# EasyEDA Pro project 穿越机H7飞控工程文件（241123）.epro, board H743FC4FPV_v0.5
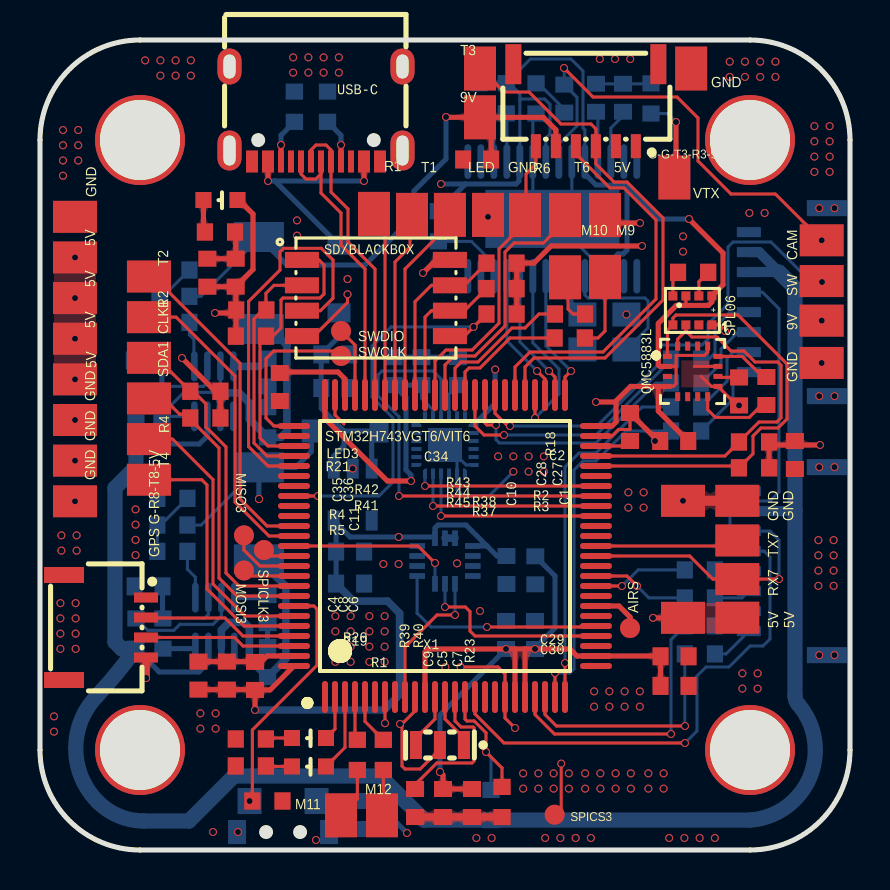
[diagram p26: board, top side]
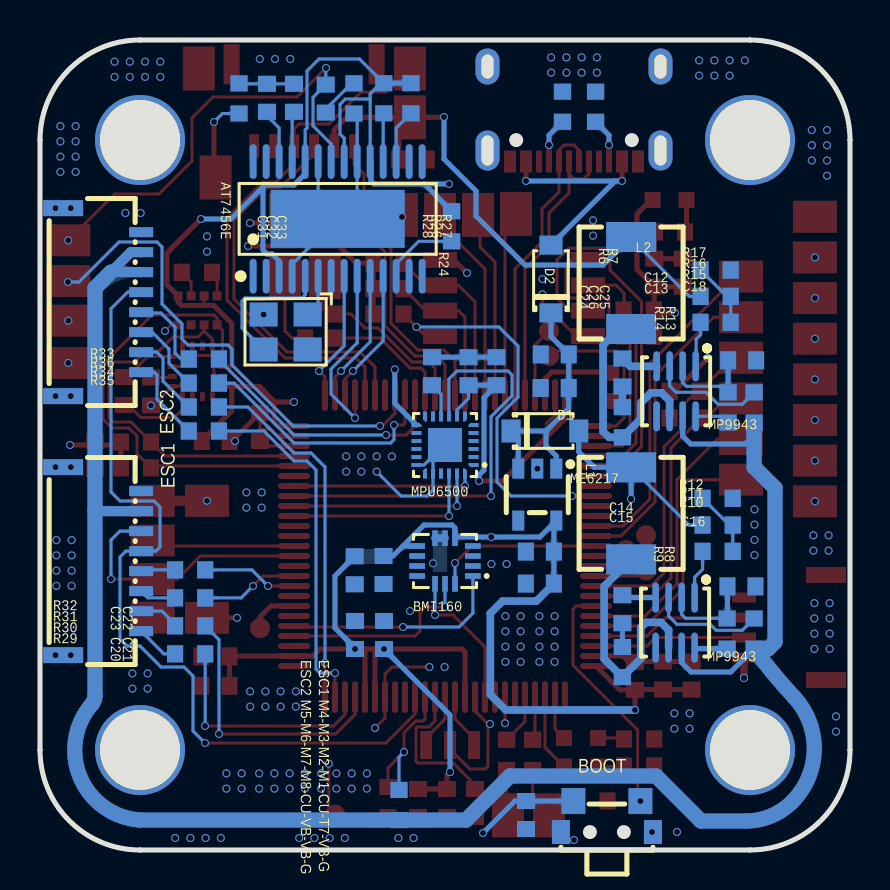
[diagram p27: board, bottom side, seen from below]

Outline 40.5 x 40.5 mm; copper layers: Top Layer, Inner1, Inner2, Bottom Layer. Coordinates in mm from the lower left corner of the outline.
Outline path: 0,35.5 0,5 arc(1.46,1.46) 5,0 35.5,0 arc(39.04,1.46) 40.5,5 40.5,35.5 arc(39.04,39.04) 35.5,40.5 5,40.5 arc(1.46,39.04) 0,35.5
Stack: Top Layer 0.035mm 外层铜厚1oz / Dielectric1 0.2104mm 7628 RC49% 8.6mil / Inner1 0.0152mm 内层铜厚 / Dielectric2 1.065mm 1.1mm H/HOZ 含铜 / Inner2 0.0152mm 内层铜厚 / Dielectric3 0.2104mm 7628 RC49% 8.6mil / Bottom Layer 0.035mm 外层铜厚1oz

## Design rules (mm)
template: 自定义配置
spacing copperThickness1oz (default): track to track 0.102, other pairs 0 to 0.3
spacing copperThickness2oz: track to track 0.203, other pairs 0.152 to 0.3
track width copperThickness1oz (default): min 0.127, default 0.254, max 2.54
track width copperThickness2oz: min 0.203, default 0.254, max 2.54
differential pair differentialPair (default): width min 0.127, default 0.254, max 2.54; gap min 0.152, default 0.152
via viaSize (default): diameter min 0.203, default 0.61, max 10; hole min 0.152, default 0.305, max 6.299

## Placement (name value [footprint] x y rotation side)
5V  -  [焊盘1.6*2.2mm]  29.05 32.85 180 top
5V#2  -  [焊盘1.6*2.2mm]  2.85 24.76 90 top
5V#3  -  [焊盘1.6*2.2mm]  35.97 10.81 90 top
5V#4  -  [焊盘1.6*2.2mm]  0.65 24.33 270 top
5V#5  -  [焊盘1.6*2.2mm]  2.85 26.8 90 top
5V#6  -  [焊盘1.6*2.2mm]  33.25 10.81 90 top
5V#7  -  [焊盘1.6*2.2mm]  0.65 30.43 270 top
9V  -  [焊盘1.6*2.2mm]  21.2 35.53 0 top
9V#2  -  [焊盘1.6*2.2mm]  37.99 27.27 270 top
27MHZ  27MHz  [OSC-SMD_4P-L3.2-W2.5-BL]  28.22 25.9 0 bottom
AIRS  -  [焊盘_圆——Debug]  29.5 11.1 0 top
AT7456E  AT7456E  [TSSOP-28_L9.7-W4.4-P0.65-LS6.4-BL-EP-2]  25.62 31.56 180 bottom
BMI160  BMI160  [LGA-14_L3.0-W2.5-P0.50-BL]  20.25 14.45 90 bottom
C1  100nF  [C0603]  37.75 19.75 270 top
C2  100nF  [C0603]  31.71 20.45 180 top
C3  100nF  [C0603]  16.2 1.75 270 bottom
C4  100nF  [C0603]  7.92 8.72 90 top
C5  100nF  [C0603]  20.15 2.35 270 top
C6  4.7uF  [C0603]  10.75 8.7 270 top
C7  100nF  [C0603]  21.6 2.35 270 top
C8  1uF  [C0603]  9.35 8.72 90 top
C9  100nF  [C0603]  18.75 2.35 270 top
C10  2.2uF  [C0603]  29.5 21.15 90 top
C11  2.2uF  [C0603]  11.99 23.15 270 top
C12  100nF  [C0603]  14.76 24.78 180 bottom
C13  22uF  [C0603]  14.76 23.1 180 bottom
C14  100nF  [C0603]  15.51 14.92 180 bottom
C15  22uF  [C0603]  15.51 13.32 180 bottom
C16  100nF  [C0603]  5.43 13.18 0 bottom
C17  100nF  [C0603]  11.38 12.04 270 bottom
C18  100nF  [C0603]  5.39 24.48 0 bottom
C19  100nF  [C0603]  11.38 23.88 270 bottom
C20  100nF  [C0603]  24.75 10.75 270 bottom
C21  100nF  [C0603]  23.3 10.75 270 bottom
C22  100nF  [C0603]  23.32 14 90 bottom
C23  100nF  [C0603]  24.76 13.98 90 bottom
C24  100nF  [C0603]  20.9 23.94 270 bottom
C25  100nF  [C0603]  17.68 23.94 270 bottom
C26  10nF  [C0603]  19.07 23.94 270 bottom
C27  220nF  [C0603]  36.32 22.95 270 top
C28  4.7uF  [C0603]  34.95 22.93 270 top
C29  100nF  [C0603]  31.73 9.68 180 top
C30  100nF  [C0603]  31.73 8.21 180 top
C31  22uF  [C0603]  29.15 37.61 90 bottom
C32  22uF  [C0603]  27.8 37.61 90 bottom
C33  100nF  [C0603]  26.21 37.57 90 bottom
C34  100nF  [C0603]  21.86 34.53 0 top
C35  10nF  [C0603]  9.78 28.87 90 top
C36  100nF  [C0603]  8.37 28.87 90 top
CAM  -  [焊盘1.6*2.2mm]  40.19 29.68 90 top
CLK1  -  [焊盘1.6*2.2mm]  6.55 23.81 90 top
D1  1N5819W  [SOD-123_L2.8-W1.8-LS3.7-RD]  15.26 20.95 180 bottom
D2  1N5819W  [SOD-123_L2.8-W1.8-LS3.7-RD]  14.95 28.55 90 bottom
ESC1 M4-M3-M2-M1-CU-T7-VB-G  HDGC1002WR-S-8P  [CONN-SMD_8P-P1.00_HDGC_HDGC1002WR-S-8P]  37.39 14.44 270 bottom
ESC2 M5-M6-M7-M8-CU-VB-VB-G  HDGC1002WR-S-8P  [conn-smd_8p-p1.00_hdgc_hdgc1002wr-s-8p]  37.39 27.39 270 bottom
G-G-T3-R3-9V-R6  HDGC1002WR-S-6P  [CONN-SMD_6P-P1.00_HDGC1002WR-S-6P]  27.29 37.24 180 top
GND  -  [焊盘1.6*2.2mm]  40.19 23.55 90 top
GND#2  -  [焊盘1.6*2.2mm]  31.76 37.97 0 top
GND#3  -  [焊盘1.6*2.2mm]  23.2 32.86 180 top
GND#4  -  [焊盘1.6*2.2mm]  2.85 18.67 90 top
GND#5  -  [焊盘1.6*2.2mm]  33.25 16.66 90 top
GND#6  -  [焊盘1.6*2.2mm]  0.65 22.3 270 top
GND#7  -  [焊盘1.6*2.2mm]  35.97 16.66 90 top
GND#8  -  [焊盘1.6*2.2mm]  2.85 16.64 90 top
GND#9  -  [焊盘1.6*2.2mm]  0.65 32.46 270 top
GPS G-R8-T8-5V  HDGC1002WR-S-4P  [CONN-SMD_4P-P1.00_HDGC_HDGC1002WR-S-4P]  3.25 11.12 270 top
L1  10uH  [IND-SMD_L5.5-W5.2]  10.94 16.83 90 bottom
L2  10uH  [IND-SMD_L5.5-W5.2]  10.94 28.35 90 bottom
LED  -  [焊盘1.6*2.2mm]  19.7 30.66 0 top
LED1  NCD0603R3  [LED0603-R-RD_RED]  13.45 5.6 0 top
LED2  NCD0603R3  [LED0603-R-RD_RED]  13.45 4.18 0 top
LED3  NCD0603R3  [LED0603-R-RD_RED]  9.02 32.5 0 top
M9  -  [焊盘1.6*2.2mm]  29.05 29.75 180 top
M10  -  [焊盘1.6*2.2mm]  27.05 29.74 180 top
M11  -  [焊盘1.6*2.2mm]  15.85 2.83 180 top
M12  -  [焊盘1.6*2.2mm]  17.9 2.83 180 top
ME6217  ME6217C33M5G  [SOT-23-5_L3.0-W1.7-P0.95-LS2.8-BR]  15.64 17.77 90 bottom
MP9943  -  [QFN-8_L3.0-W3.0-P0.65-BL]  8.74 11.37 0 bottom
MP9943#2  -  [QFN-8_L3.0-W3.0-P0.65-BL]  8.69 22.93 0 bottom
MPU6500  MPU6500  [QFN-24_L3.0-W3.0-P0.40-BL-EP]  20.25 20.25 90 bottom
NOREF  -  [Pad_e156]  5 35.5 0 top
NOREF#2  -  [Pad_e1514]  35.5 35.5 0 top
NOREF#3  -  [Pad_e158]  5 5 0 top
NOREF#4  -  [Pad_e157]  35.5 5 0 top
QMC5883L  QMC5883L  [LGA-16_L3.0-W3.0-P0.50-BL_SQ]  32.63 23.93 270 top
R1  10K  [R0603]  11.37 2.45 0 top
R1#2  -  [焊盘1.6*2.2mm]  17.5 32.91 180 top
R2  2.2K  [R0603]  35.7 20.4 180 top
R2#2  -  [焊盘1.6*2.2mm]  6.55 25.84 90 top
R3  2.2K  [R0603]  35.7 19.11 180 top
R4  2.2K  [R0603]  8.27 22.94 0 top
R4#2  -  [焊盘1.6*2.2mm]  4.35 21.35 270 top
R5  2.2K  [R0603]  8.27 21.6 0 top
R6  5.1kΩ  [焊盘1.6*2.2mm]  23.45 30.65 0 top
R6#2  -  [R0603]  14.38 37.16 270 bottom
R7  5.1kΩ  [R0603]  12.72 37.16 270 bottom
R8  10K  [R0603]  4.79 10.82 90 bottom
R9  100K  [R0603]  6.14 10.82 270 bottom
R10  51K  [R0603]  6.62 14.93 180 bottom
R11  41.2K  [R0603]  6.62 16.25 0 bottom
R12  7.68K  [R0603]  6.62 17.58 0 bottom
R13  10K  [R0603]  4.79 22.13 90 bottom
R14  100K  [R0603]  6.09 22.13 270 bottom
R15  51K  [R0603]  6.72 26.38 180 bottom
R16  41.2K  [R0603]  6.72 27.68 0 bottom
R17  4.02K  [R0603]  6.72 29 0 bottom
R18  100K  [R0603]  32.66 28.88 180 top
R19  470R  [R0603]  10.54 5.55 180 top
R20  470R  [R0603]  10.54 4.2 180 top
R21  470R  [R0603]  9 30.9 0 top
R22  10K  [R0603]  22.55 2.25 270 bottom
R23  1K  [R0603]  23.1 2.4 90 top
R24  1K  [R0603]  19.92 31.19 90 bottom
R25  75R  [R0603]  30.55 37.58 270 bottom
R26  10K  [R0603]  23.31 37.59 90 bottom
R27  10K  [R0603]  21.95 37.59 90 bottom
R28  75R  [R0603]  24.8 37.58 90 bottom
R29  120R  [R0603]  32.99 9.81 180 bottom
R30  120R  [R0603]  32.99 11.21 180 bottom
R31  120R  [R0603]  32.99 12.61 180 bottom
R32  120R  [R0603]  32.99 14.01 180 bottom
R33  120R  [R0603]  32.31 24.55 180 bottom
R34  120R  [R0603]  32.31 22.15 180 bottom
R35  120R  [R0603]  32.31 20.95 180 bottom
R36  120R  [R0603]  32.31 23.34 180 bottom
R37  120R  [R0603]  26.49 25.6 180 top
R38  120R  [R0603]  26.5 26.8 180 top
R39  120R  [R0603]  15.87 4.75 90 top
R40  120R  [R0603]  17.17 4.75 90 top
R41  10K  [R0603]  10.55 25.69 180 top
R42  10K  [R0603]  10.56 27 180 top
R43  10K  [R0603]  23.08 29.34 180 top
R44  10K  [R0603]  23.08 28.07 180 top
R45  10K  [R0603]  23.08 26.8 180 top
R46  20R  [R0603]  11.38 9.4 90 bottom
R47  20R  [R0603]  11.38 21.39 90 bottom
RX7  -  [焊盘1.6*2.2mm]  35.97 12.75 90 top
SD/BLACKBOX  CSNP1GCR01-BOW  [LGA-8_L6.0-W8.0-P1.27-TL]  16.8 27.6 0 top
SDA1  -  [焊盘1.6*2.2mm]  6.55 21.78 90 top
SPICS3  -  [焊盘_圆——Debug]  25.73 1.76 0 top
SPL06  SPL06-001  [SENSOR-SMD_SPL06-001]  32.62 26.98 0 top
STM32H743VGT6/VIT6  STM32H743VGT6  [LQFP-100_L14.0-W14.0-P0.50-LS16.0-BL]  20.25 15.2 0 top
SW  -  [焊盘1.6*2.2mm]  40.19 27.65 90 top
SW1  TS24CA  [SW-SMD_TS24CA]  12.15 1.67 0 bottom
SWCLK  -  [焊盘_圆——Debug]  15.05 24.7 0 top
SWDIO  -  [焊盘_圆——Debug]  15.05 25.95 0 top
T1  -  [焊盘1.6*2.2mm]  19.4 32.86 180 top
T2  -  [焊盘1.6*2.2mm]  6.55 27.87 90 top
T3  -  [焊盘1.6*2.2mm]  21.2 37.97 0 top
T4  -  [焊盘1.6*2.2mm]  4.35 19.31 270 top
T6  -  [焊盘1.6*2.2mm]  25.45 30.65 0 top
TX7  -  [焊盘1.6*2.2mm]  35.97 14.68 90 top
U16  -  [焊盘_圆——Debug]  10.2 13.98 0 top
U17  -  [焊盘_圆——Debug]  10.2 15.74 0 top
U18  -  [焊盘_圆——Debug]  11.2 15 0 top
USB-C  TYPE-C 16PIN 2MD(073)  [USB-C-SMD_TYPE-C-6PIN-2MD-073]  13.8 36.8 180 top
VTX  -  [焊盘1.6*2.2mm]  30.92 32.53 0 top
X1  8M  [OSC-SMD_3P-L3.2-W1.3-P1.20-L]  20 5.25 180 top

## Footprints (pads in the part's own frame, mm; a bottom-side part is the same pattern mirrored in y, then rotated)
C0603
  rect 0.8x0.9 smd: 1(-0.7,0) 2(0.7,0)
CONN-SMD_4P-P1.00_HDGC_HDGC1002WR-S-4P
  rect 0.5x1.2 smd: 1(-1.5,2.05) 2(-0.5,2.05) 3(0.5,2.05) 4(1.5,2.05)
  rect 0.8x2 smd: 5(2.625,-2.05) 6(-2.625,-2.05)
CONN-SMD_6P-P1.00_HDGC1002WR-S-6P
  rect 0.5x1.2 smd: 1(-2.5,2.05) 2(-1.5,2.05) 3(-0.5,2.05) 4(0.5,2.05) 5(1.5,2.05) 6(2.5,2.05)
  rect 0.8x2 smd: 7(3.625,-2.05) 8(-3.625,-2.05)
conn-smd_8p-p1.00_hdgc_hdgc1002wr-s-8p
  rect 0.5x1.2 smd: 1(-3.5,1.95) 2(-2.5,1.95) 3(-1.5,1.95) 4(-0.5,1.95) 5(0.5,1.95) 6(1.5,1.95) 7(2.5,1.95) 8(3.5,1.95)
  rect 0.8x2 smd: 9(4.7,-1.95) 10(-4.7,-1.95)
CONN-SMD_8P-P1.00_HDGC_HDGC1002WR-S-8P
  rect 0.5x1.2 smd: 1(-3.5,1.95) 2(-2.5,1.95) 3(-1.5,1.95) 4(-0.5,1.95) 5(0.5,1.95) 6(1.5,1.95) 7(2.5,1.95) 8(3.5,1.95)
  rect 0.8x2 smd: 9(4.7,-1.95) 10(-4.7,-1.95)
IND-SMD_L5.5-W5.2
  rect 1.5x2.5 smd: 1(-2.3,0) 2(2.3,0)
LED0603-R-RD_RED
  rect 0.8x0.8 smd: 1(0.851,0) 2(-0.851,0)
LGA-8_L6.0-W8.0-P1.27-TL
  rect 1.7x0.8 smd: 1(-3.7,1.905) 2(-3.7,0.635) 3(-3.7,-0.635) 4(-3.7,-1.905) 5(3.7,-1.905) 6(3.7,-0.635) 7(3.7,0.635) 8(3.7,1.905)
LGA-14_L3.0-W2.5-P0.50-BL
  rect 0.28x0.785 smd: 1(-0.75,-1.393) 2(-0.25,-1.393) 3(0.25,-1.393) 4(0.75,-1.393) 8(0.75,1.393) 9(0.25,1.393) 10(-0.25,1.393) 11(-0.75,1.393)
  rect 0.785x0.28 smd: 5(1.143,-0.5) 6(1.143,0) 7(1.143,0.5) 12(-1.143,0.5) 13(-1.143,0) 14(-1.143,-0.5)
LGA-16_L3.0-W3.0-P0.50-BL_SQ
  rect 0.25x0.45 smd: 1(-0.75,-1.263) 2(-0.25,-1.263) 3(0.25,-1.263) 4(0.75,-1.263) 9(0.75,1.263) 10(0.25,1.263) 11(-0.25,1.263) 12(-0.75,1.263)
  rect 0.45x0.25 smd: 5(1.263,-0.75) 6(1.263,-0.25) 7(1.263,0.25) 8(1.263,0.75) 13(-1.263,0.75) 14(-1.263,0.25) 15(-1.263,-0.25) 16(-1.263,-0.75)
LQFP-100_L14.0-W14.0-P0.50-LS16.0-BL
  oval 0.3x1.6 smd: 1(-6,-7.55) 2(-5.5,-7.55) 3(-5,-7.55) 4(-4.5,-7.55) 5(-4,-7.55) 6(-3.5,-7.55) 7(-3,-7.55) 8(-2.5,-7.55) 9(-2,-7.55) 10(-1.5,-7.55) 11(-1,-7.55) 12(-0.5,-7.55) 13(0,-7.55) 14(0.5,-7.55) 15(1,-7.55) 16(1.5,-7.55) 17(2,-7.55) 18(2.5,-7.55) 19(3,-7.55) 20(3.5,-7.55) 21(4,-7.55) 22(4.5,-7.55) 23(5,-7.55) 24(5.5,-7.55) 25(6,-7.55) 51(6,7.55) 52(5.5,7.55) 53(5,7.55) 54(4.5,7.55) 55(4,7.55) 56(3.5,7.55) 57(3,7.55) 58(2.5,7.55) 59(2,7.55) 60(1.5,7.55) 61(1,7.55) 62(0.5,7.55) 63(0,7.55) 64(-0.5,7.55) 65(-1,7.55) 66(-1.5,7.55) 67(-2,7.55) 68(-2.5,7.55) 69(-3,7.55) 70(-3.5,7.55) 71(-4,7.55) 72(-4.5,7.55) 73(-5,7.55) 74(-5.5,7.55) 75(-6,7.55)
  oval 1.6x0.3 smd: 26(7.55,-6) 27(7.55,-5.5) 28(7.55,-5) 29(7.55,-4.5) 30(7.55,-4) 31(7.55,-3.5) 32(7.55,-3) 33(7.55,-2.5) 34(7.55,-2) 35(7.55,-1.5) 36(7.55,-1) 37(7.55,-0.5) 38(7.55,0) 39(7.55,0.5) 40(7.55,1) 41(7.55,1.5) 42(7.55,2) 43(7.55,2.5) 44(7.55,3) 45(7.55,3.5) 46(7.55,4) 47(7.55,4.5) 48(7.55,5) 49(7.55,5.5) 50(7.55,6) 76(-7.55,6) 77(-7.55,5.5) 78(-7.55,5) 79(-7.55,4.5) 80(-7.55,4) 81(-7.55,3.5) 82(-7.55,3) 83(-7.55,2.5) 84(-7.55,2) 85(-7.55,1.5) 86(-7.55,1) 87(-7.55,0.5) 88(-7.55,0) 89(-7.55,-0.5) 90(-7.55,-1) 91(-7.55,-1.5) 92(-7.55,-2) 93(-7.55,-2.5) 94(-7.55,-3) 95(-7.55,-3.5) 96(-7.55,-4) 97(-7.55,-4.5) 98(-7.55,-5) 99(-7.55,-5.5) 100(-7.55,-6)
OSC-SMD_3P-L3.2-W1.3-P1.20-L
  rect 0.6x1.4 smd: 1(-1.199,0) 2(0,0) 3(1.199,0)
OSC-SMD_4P-L3.2-W2.5-BL
  rect 1.4x1.2 smd: 1(-1.1,-0.875) 2(1.1,-0.875) 3(1.1,0.875) 4(-1.1,0.875)
Pad_e156
  round 4.5 hole 4: 101(0,0)
Pad_e157
  round 4.5 hole 4: 101(0,0)
Pad_e158
  round 4.5 hole 4: 101(0,0)
Pad_e1514
  round 4.5 hole 4: 101(0,0)
QFN-8_L3.0-W3.0-P0.65-BL
  oval 0.33x1.5 smd: 1(-0.975,-1.25) 2(-0.325,-1.25) 3(0.325,-1.25) 4(0.975,-1.25) 5(0.975,1.25) 6(0.325,1.25) 7(-0.325,1.25) 8(-0.975,1.25)
QFN-24_L3.0-W3.0-P0.40-BL-EP
  custom 0.2x0.506 smd: 1(-1,-1.427) 6(1,-1.427) 13(1,1.427) 18(-1,1.427)
  rect 0.2x0.505 smd: 2(-0.6,-1.427) 3(-0.2,-1.427) 4(0.2,-1.427) 5(0.6,-1.427) 14(0.6,1.427) 15(0.2,1.427) 16(-0.2,1.427) 17(-0.6,1.427)
  custom 0.506x0.2 smd: 7(1.427,-1) 12(1.427,1) 19(-1.427,1) 24(-1.427,-1)
  rect 0.505x0.2 smd: 8(1.427,-0.6) 9(1.427,-0.2) 10(1.427,0.2) 11(1.427,0.6) 20(-1.427,0.6) 21(-1.427,0.2) 22(-1.427,-0.2) 23(-1.427,-0.6)
  rect 1.7x1.7 smd: 25(0,0)
R0603
  rect 0.806x0.864 smd: 1(-0.753,0) 2(0.753,0)
SENSOR-SMD_SPL06-001
  rect 0.45x0.45 smd: 1(0.975,-0.725) 2(0.325,-0.725) 3(-0.325,-0.725) 4(-0.975,-0.725) 5(-0.975,0.725) 6(-0.325,0.725) 7(0.325,0.725) 8(0.975,0.725)
SOD-123_L2.8-W1.8-LS3.7-RD
  rect 0.95x1.15 smd: 1(-1.692,0) 2(1.692,0)
SOT-23-5_L3.0-W1.7-P0.95-LS2.8-BR
  rect 1x0.6 smd: 1(1.3,-0.95) 2(1.3,0) 3(1.3,0.95) 4(-1.3,0.95) 5(-1.3,-0.95)
SW-SMD_TS24CA
  rect 0.9x1.2 smd: 1(-2.3,0.775) 2(2.3,0.775)
  rect 1.2x1.3 smd: 3(-1.675,-0.775) 4(1.675,-0.775)
TSSOP-28_L9.7-W4.4-P0.65-LS6.4-BL-EP-2
  oval 0.343x1.732 smd: 1(-4.225,-2.866) 2(-3.575,-2.866) 3(-2.925,-2.866) 4(-2.275,-2.866) 5(-1.625,-2.866) 6(-0.975,-2.866) 7(-0.325,-2.866) 8(0.325,-2.866) 9(0.975,-2.866) 10(1.625,-2.866) 11(2.275,-2.866) 12(2.925,-2.866) 13(3.575,-2.866) 14(4.225,-2.866) 15(4.225,2.866) 16(3.575,2.866) 17(2.925,2.866) 18(2.275,2.866) 19(1.625,2.866) 20(0.975,2.866) 21(0.325,2.866) 22(-0.325,2.866) 23(-0.975,2.866) 24(-1.625,2.866) 25(-2.275,2.866) 26(-2.925,2.866) 27(-3.575,2.866) 28(-4.225,2.866)
  rect 6.7x2.9 smd: 29(0,0)
USB-C-SMD_TYPE-C-6PIN-2MD-073
  rect 0.6x1.1 smd: 1(-3.2,2.375) 2(-2.4,2.375) 11(2.4,2.375) 12(3.2,2.375)
  rect 0.3x1.1 smd: 3(-1.75,2.375) 4(-1.25,2.375) 5(-0.75,2.375) 6(-0.25,2.375) 7(0.25,2.375) 8(0.75,2.375) 9(1.25,2.375) 10(1.75,2.375)
  oval 1.2x2 hole 0.6x1.5: 13(-4.325,1.825) 14(4.325,1.825)
  oval 1.2x1.8 hole 0.6x1.2: 13(-4.325,-2.375) 14(4.325,-2.375)
焊盘1.6*2.2mm
  rect 1.6x2.2 smd: 1(0.8,1.1)
焊盘_圆——Debug
  round 1 smd: 1(0,0)

## Nets
4V5: C12.2 C13.2 D1.1 D2.1 ME6217.1 ME6217.3
5V_BEC: 5V.1 5V#2.1 5V#3.1 5V#4.1 5V#5.1 5V#6.1 5V#7.1 D1.2 GPS G-R8-T8-5V.4 L1.2 R11.2
5V_USB: D2.2 USB-C.2 USB-C.11
9V_BEC: 9V.1 9V#2.1 C34.2 G-G-T3-R3-9V-R6.5 L2.2 R16.2
GND: 27MHZ.2 27MHZ.4 AT7456E.4 AT7456E.20 AT7456E.23 AT7456E.29 BMI160.6 BMI160.7 C1.2 C2.2 C3.2 C4.2 C5.2 C6.1 C7.2 C8.2 C9.2 C10.2 C11.2 C12.1 C13.1 C14.1 C15.1 C16.1 C18.1 C20.1 C21.1 C22.1 C23.1 C24.1 C25.1 C26.1 C28.2 C29.1 C30.1 C34.1 C35.2 C36.2 ESC1 M4-M3-M2-M1-CU-T7-VB-G.1 ESC1 M4-M3-M2-M1-CU-T7-VB-G.9 ESC1 M4-M3-M2-M1-CU-T7-VB-G.10 ESC2 M5-M6-M7-M8-CU-VB-VB-G.1 ESC2 M5-M6-M7-M8-CU-VB-VB-G.9 ESC2 M5-M6-M7-M8-CU-VB-VB-G.10 G-G-T3-R3-9V-R6.1 G-G-T3-R3-9V-R6.2 G-G-T3-R3-9V-R6.7 G-G-T3-R3-9V-R6.8 GND.1 GND#2.1 GND#3.1 GND#4.1 GND#5.1 GND#6.1 GND#7.1 GND#8.1 GND#9.1 GPS G-R8-T8-5V.1 GPS G-R8-T8-5V.5 GPS G-R8-T8-5V.6 ME6217.2 MP9943.5 MP9943#2.5 MPU6500.18 MPU6500.20 MPU6500.25 NOREF.101 NOREF#2.101 NOREF#3.101 NOREF#4.101 QMC5883L.9 QMC5883L.11 R1.2 R6#2.1 R7.1 R12.1 R17.1 R18.1 R19.2 R20.2 R21.2 R23.1 R28.1 SD/BLACKBOX.4 SPL06.1 SPL06.7 STM32H743VGT6/VIT6.10 STM32H743VGT6/VIT6.19 STM32H743VGT6/VIT6.26 STM32H743VGT6/VIT6.49 STM32H743VGT6/VIT6.74 STM32H743VGT6/VIT6.99 SW1.1 SW1.2 USB-C.1 USB-C.12 USB-C.13 USB-C.14 X1.2
VBAT: ESC1 M4-M3-M2-M1-CU-T7-VB-G.2 ESC2 M5-M6-M7-M8-CU-VB-VB-G.2 ESC2 M5-M6-M7-M8-CU-VB-VB-G.3 MP9943.7 MP9943#2.7 R8.1 R13.1 R22.2
VDD_MCU: AT7456E.3 AT7456E.19 AT7456E.21 AT7456E.24 BMI160.5 BMI160.8 C1.1 C2.1 C3.1 C4.1 C5.1 C6.2 C7.1 C8.1 C14.2 C15.2 C20.2 C21.2 C22.2 C23.2 C25.2 C26.2 C29.2 C30.2 C35.1 C36.1 LED3.1 ME6217.5 MPU6500.8 MPU6500.13 QMC5883L.2 QMC5883L.4 QMC5883L.13 R2.1 R3.1 R4.2 R5.2 R24.2 R26.2 R27.2 R41.2 R42.2 R43.1 R44.1 R45.1 SD/BLACKBOX.8 SPL06.6 SPL06.8 STM32H743VGT6/VIT6.11 STM32H743VGT6/VIT6.20 STM32H743VGT6/VIT6.21 STM32H743VGT6/VIT6.27 STM32H743VGT6/VIT6.50 STM32H743VGT6/VIT6.75 STM32H743VGT6/VIT6.100 SW1.4
AIRS: AIRS.1 STM32H743VGT6/VIT6.32
BEEPER: STM32H743VGT6/VIT6.77
BOOT0: R1.1 STM32H743VGT6/VIT6.94 SW1.3
CAN_RX: STM32H743VGT6/VIT6.82
CAN_TX: STM32H743VGT6/VIT6.81
EXTI_CS1: STM32H743VGT6/VIT6.85
EXTI_CS2: STM32H743VGT6/VIT6.1
FB_5V: MP9943.1 R10.1
FB_9V: MP9943#2.1 R15.1
I2C1_CLK: CLK1.1 R4.1 STM32H743VGT6/VIT6.92
I2C1_SDA: R5.1 SDA1.1 STM32H743VGT6/VIT6.93
I2C2_SCL: QMC5883L.1 R3.2 SPL06.4 STM32H743VGT6/VIT6.46
I2C2_SDA: QMC5883L.16 R2.2 SPL06.3 STM32H743VGT6/VIT6.47
LC_5V: L1.1 MP9943.6 R46.1
LC_9V: L2.1 MP9943#2.6 R47.1
LED_0: LED1.1 STM32H743VGT6/VIT6.2
LED_1: LED2.1 STM32H743VGT6/VIT6.3
NRST: C9.1 STM32H743VGT6/VIT6.14
OTG_FS_DM: STM32H743VGT6/VIT6.70 USB-C.5 USB-C.7
OTG_FS_DP: STM32H743VGT6/VIT6.71 USB-C.6 USB-C.8
PWM_1: R32.2 STM32H743VGT6/VIT6.34
PWM_2: R31.2 STM32H743VGT6/VIT6.35
PWM_3: R30.2 STM32H743VGT6/VIT6.22
PWM_4: R29.2 STM32H743VGT6/VIT6.23
PWM_5: R35.2 STM32H743VGT6/VIT6.24
PWM_6: R34.2 STM32H743VGT6/VIT6.25
PWM_7: R36.2 STM32H743VGT6/VIT6.59
PWM_8: R33.2 STM32H743VGT6/VIT6.60
PWM_9: R37.2 STM32H743VGT6/VIT6.61
PWM_10: R38.2 STM32H743VGT6/VIT6.62
PWM_11: R39.2 STM32H743VGT6/VIT6.4
PWM_12: R40.2 STM32H743VGT6/VIT6.5
PWM_SW_2812: LED.1 STM32H743VGT6/VIT6.67
RSSI: STM32H743VGT6/VIT6.33
SDIO_CLK: SD/BLACKBOX.3 STM32H743VGT6/VIT6.80
SDIO_CMD: R45.2 SD/BLACKBOX.5 STM32H743VGT6/VIT6.83
SDIO_D0: R44.2 SD/BLACKBOX.6 STM32H743VGT6/VIT6.65
SDIO_D1: R43.2 SD/BLACKBOX.7 STM32H743VGT6/VIT6.66
SDIO_D2: R41.1 SD/BLACKBOX.1 STM32H743VGT6/VIT6.78
SDIO_D3: R42.1 SD/BLACKBOX.2 STM32H743VGT6/VIT6.79
SENS_CUR: ESC1 M4-M3-M2-M1-CU-T7-VB-G.4 ESC2 M5-M6-M7-M8-CU-VB-VB-G.4 STM32H743VGT6/VIT6.16
SENS_VOL: R22.1 R23.2 STM32H743VGT6/VIT6.15
SPI1_IMU1_CS: BMI160.12 STM32H743VGT6/VIT6.9
SPI1_MISO: BMI160.1 STM32H743VGT6/VIT6.30
SPI1_MOSI: BMI160.14 STM32H743VGT6/VIT6.88
SPI1_SCLK: BMI160.13 STM32H743VGT6/VIT6.29
SPI2_MISO: AT7456E.11 STM32H743VGT6/VIT6.53
SPI2_MOSI: AT7456E.9 STM32H743VGT6/VIT6.54
SPI2_OSD_CS: AT7456E.8 STM32H743VGT6/VIT6.51
SPI2_SCLK: AT7456E.10 STM32H743VGT6/VIT6.52
SPI3_IMU3_CS: SPICS3.1 STM32H743VGT6/VIT6.7
SPI3_MISO: STM32H743VGT6/VIT6.90 U17.1
SPI3_MOSI: STM32H743VGT6/VIT6.91 U16.1
SPI3_SCLK: STM32H743VGT6/VIT6.89 U18.1
SPI4_IMU2_CS: MPU6500.22 STM32H743VGT6/VIT6.41
SPI4_MISO: MPU6500.9 STM32H743VGT6/VIT6.43
SPI4_MOSI: MPU6500.24 STM32H743VGT6/VIT6.44
SPI4_SCLK: MPU6500.23 STM32H743VGT6/VIT6.42
SW_CAMERA: STM32H743VGT6/VIT6.58 SW.1
SW_POWER: STM32H743VGT6/VIT6.57
SWD_SWCLK: STM32H743VGT6/VIT6.76 SWCLK.1
SWD_SWDIO: STM32H743VGT6/VIT6.72 SWDIO.1
UART1_RX: R1#2.1 STM32H743VGT6/VIT6.69
UART1_TX: STM32H743VGT6/VIT6.68 T1.1
UART2_RX: R2#2.1 STM32H743VGT6/VIT6.87
UART2_TX: STM32H743VGT6/VIT6.86 T2.1
UART3_RX: G-G-T3-R3-9V-R6.4 STM32H743VGT6/VIT6.56
UART3_TX: G-G-T3-R3-9V-R6.3 STM32H743VGT6/VIT6.55 T3.1
UART4_RX: R4#2.1 STM32H743VGT6/VIT6.95
UART4_TX: STM32H743VGT6/VIT6.96 T4.1
UART6_RX: G-G-T3-R3-9V-R6.6 R6.1 STM32H743VGT6/VIT6.64
UART6_TX: STM32H743VGT6/VIT6.63 T6.1
UART7_CTS: STM32H743VGT6/VIT6.40
UART7_RTS: STM32H743VGT6/VIT6.39
UART7_RX: ESC1 M4-M3-M2-M1-CU-T7-VB-G.3 RX7.1 STM32H743VGT6/VIT6.37
UART7_TX: STM32H743VGT6/VIT6.38 TX7.1
UART8_RX: GPS G-R8-T8-5V.2 STM32H743VGT6/VIT6.97
UART8_TX: GPS G-R8-T8-5V.3 STM32H743VGT6/VIT6.98
VCAP1: C10.1 STM32H743VGT6/VIT6.48
VCAP2: C11.1 STM32H743VGT6/VIT6.73
VIDIN: AT7456E.22 C33.2 CAM.1
VTX: R25.2 VTX.1
$1N2867: STM32H743VGT6/VIT6.12 X1.3
$1N2871: STM32H743VGT6/VIT6.13 X1.1
$1N3300: R7.2 USB-C.10
$1N3472: R6#2.2 USB-C.4
$1N5215: MP9943.3 R8.2
$1N5401: C17.1 MP9943.4
$1N5477: C16.2 MP9943.2 R9.1
$1N5478: MP9943.8 R9.2
$1N5616: R10.2 R11.1 R12.2
$1N5946: MP9943#2.3 R13.2
$1N5955: C19.1 MP9943#2.4
$1N5966: C18.2 MP9943#2.2 R14.1
$1N5971: MP9943#2.8 R14.2
$1N5978: R15.2 R16.1 R17.2
$1N6188: R18.2 SPL06.5
$1N7216: C24.2 MPU6500.10
$1N7601: C27.2 QMC5883L.8
$1N7606: C27.1 QMC5883L.12
$1N7687: C28.1 QMC5883L.10
$1N8096: LED1.2 R19.1
$1N8099: LED2.2 R20.1
$1N8102: LED3.2 R21.1
$1N8750: 27MHZ.3 AT7456E.5
$1N8757: 27MHZ.1 AT7456E.6
$1N8872: AT7456E.12 R24.1
$1N10347: AT7456E.26 C31.1
$1N10350: AT7456E.25 C32.1
$1N10453: C31.2 C32.2 R25.1
$1N10536: AT7456E.18 R26.1
$1N10539: AT7456E.17 R27.1
$1N10759: C33.1 R28.2
$1N44323: C17.2 R46.2
$1N44357: C19.2 R47.2
$2N2764: ESC1 M4-M3-M2-M1-CU-T7-VB-G.8 R29.1
$2N2888: ESC1 M4-M3-M2-M1-CU-T7-VB-G.7 R30.1
$2N2891: ESC1 M4-M3-M2-M1-CU-T7-VB-G.6 R31.1
$2N2894: ESC1 M4-M3-M2-M1-CU-T7-VB-G.5 R32.1
$2N3208: M9.1 R37.1
$2N3210: M10.1 R38.1
$2N3307: M11.1 R39.1
$2N3309: M12.1 R40.1
$2N5119: ESC2 M5-M6-M7-M8-CU-VB-VB-G.5 R33.1
$2N5121: ESC2 M5-M6-M7-M8-CU-VB-VB-G.7 R34.1
$2N5123: ESC2 M5-M6-M7-M8-CU-VB-VB-G.8 R35.1
$2N5125: ESC2 M5-M6-M7-M8-CU-VB-VB-G.6 R36.1

Pads without a net: AT7456E 1 2 7 13 14 15 16 27 28; BMI160 2 3 4 9 10 11; ME6217 4; MPU6500 1 2 3 4 5 6 7 11 12 14 15 16 17 19 21; QMC5883L 3 5 6 7 14 15; SPL06 2; STM32H743VGT6/VIT6 6 8 17 18 28 31 36 45 84; USB-C 3 9

## Via types
v1: diameter 0.4, hole 0.3, Top Layer to Bottom Layer, 244 vias

## Routing (per net, layer and track width the routed paths; a pad name or vN(x,y) marks a point on that pad's centre or on a via; arc(x,y) is an arc through that point)
4V5: length 12.6
  Bottom Layer w0.254: ME6217.3 16.59,20.59 D1.1 15.2,20.95 ; 15.2,20.95 14.06,22.09 C13.2 C12.2 14.95,25.67 D2.1 ; 15.2,20.95 15.2,20.21 14.69,19.7 ME6217.1
5V_BEC: length 105.1
  Top Layer w0.254: v1(30,31.35) 28.55,31.35 28.25,31.65 ; 5V#6.1 v1(30.65,11.61)
  Top Layer w0.381: v1(5.3,8.6) 5.3,9.63
  Inner2 w0.381: v1(5.3,8.6) 9.75,8.6 10.95,9.8 v1(10.95,17.55)
  Inner2 w0.508: v1(1.75,29.63) v1(1.75,27.6) v1(1.75,25.56) v1(1.75,23.53)
  Inner2 w0.762: v1(1.75,23.53) 1.77,23.55 4.95,23.55 ; 4.95,23.55 4.95,29.9 7.75,32.7 18.15,32.7 20.65,35.2 28.45,35.2 30,33.65 v1(30,31.35) ; 4.95,23.55 v1(10.95,17.55) 15.4,13.1 23.7,13.1 25.19,11.61 v1(30.65,11.61)
  Bottom Layer w0.152: L1.2 8.06,16.25 R11.2
  Bottom Layer w0.254: D1.2 13.56,19.91 12.78,19.13 L1.2 10.94,17.56
5V_USB: length 11.3
  Top Layer w0.254: USB-C.11 v1(11.4,33.45) ; USB-C.2 v1(16.2,33.45)
  Bottom Layer w0.254: 11.74,33.45 D2.2 ; 11.74,33.45 v1(16.2,33.45) ; 11.74,33.45 v1(11.4,33.45)
9V_BEC: length 51.6
  Top Layer w0.254: C34.2 22.56,36.08 9V.1 ; 9V.1 25.17,36.63 25.79,36.01 G-G-T3-R3-9V-R6.5 ; 9V.1 20.32,36.63 v1(20.3,36.65)
  Inner2 w0.762: v1(20.3,36.65) 28.6,36.65 38.78,26.47 v1(39.09,26.47)
  Bottom Layer w0.152: 10.99,30.63 10.98,30.62 8.04,27.68 R16.2
  Bottom Layer w0.254: v1(20.3,36.65) 20.3,34.55 18.7,32.95 18.7,31.7 16.25,29.25 12.34,29.25 10.98,30.62 L2.2
GND: length 66.5
  Top Layer w0.152: C10.2 29.5,21.04 29.49,21.03 28.93,21.03 28.6,20.7 STM32H743VGT6/VIT6.49 ; v1(23.75,6.1) 23.25,6.6 STM32H743VGT6/VIT6.19 23.25,8.8 22.9,9.15 v1(21.03,9.15) ; 18.1,6.3 18.75,6.95 STM32H743VGT6/VIT6.10 ; STM32H743VGT6/VIT6.74 14.75,21.75 15.2,21.3 ; v1(34.95,22.23) 34.85,22.23 QMC5883L.9 33.57,23.18 33.07,23.68 ; SPL06.1 33.94,26.25 v1(34.25,25.95) ; v1(18,6.3) 18.1,6.2 18.1,4.2 18.25,4.05 19.01,4.05 20,5.03 X1.2 ; R18.1 32.94,28.42 SPL06.7 ; QMC5883L.11 32.72,24.18 ; SD/BLACKBOX.4 13.69,25.69 15.38,27.38 v1(15.38,27.78)
  Top Layer w0.254: R21.2 9.78,30.87 C35.2 8.77,29.57 ; STM32H743VGT6/VIT6.99 11.35,9.7 11.05,9.4 C6.1 10.74,9.42 C8.2 C4.2 ; v1(30.75,20.45) 30.75,20.6 C10.2
  Top Layer w0.381: R23.1 23.1,1.65 C7.2 C5.2 C9.2
  Top Layer w0.508: v1(32.15,17.46) GND#7.1
  Bottom Layer w0.152: R28.1 24.64,36.66 AT7456E.20 24.64,32.53 AT7456E.29 ; AT7456E.29 27.89,29.28 AT7456E.4 ; AT7456E.29 26.59,32.53 AT7456E.23 ; v1(13.8,0.5) 14.06,0.5 SW1.2 ; MPU6500.18 21.3,19.25 20.3,20.25 MPU6500.25 20.85,19.65 MPU6500.20 20.85,18 21.15,17.7 22.45,17.7 v1(23.67,18.92)
  Bottom Layer w0.254: C24.1 C26.1 C25.1
  Bottom Layer w0.381: BMI160.6 BMI160.7
  vias: v1(0.7,6.68) v1(0.7,5.92) v1(1.02,12.34) v1(1.02,11.58) v1(1.02,10.82) v1(1.02,10.06) v1(1.15,36) v1(1.15,35.24) v1(1.15,34.48) v1(1.15,33.71) v1(1.07,15.73) v1(1.07,14.97) v1(1.75,21.5) v1(1.75,19.47) v1(1.75,17.44) v1(1.83,15.73) v1(1.83,14.97) v1(1.78,12.34) v1(1.78,11.58) v1(1.78,10.82) v1(1.78,10.06) v1(1.91,36) v1(1.91,35.24) v1(1.91,34.48) v1(4.78,17.03) v1(4.78,16.27) v1(4.78,15.51) v1(4.78,14.74) v1(5.26,39.48) v1(6.02,39.48) v1(6.02,38.72) v1(6.78,39.48) v1(6.78,38.72) v1(7.54,39.48) v1(7.54,38.72) v1(8.02,6.83) v1(8.02,6.07) v1(8.65,0.9) v1(8.78,6.83) v1(8.78,6.07) v1(9.9,0.9) v1(12.66,39.63) v1(12.66,38.87) v1(12.85,31.48) v1(12.85,30.72) v1(13.42,39.63) v1(13.42,38.87) v1(14.18,39.63) v1(14.18,38.87) v1(14.77,11.69) v1(14.77,10.93) v1(14.77,10.17) v1(14.77,9.41) v1(14.94,39.63) v1(14.94,38.87) v1(15.38,28.55) v1(15.53,11.69) v1(15.53,10.93) v1(15.53,10.17) v1(15.53,9.41) v1(15.64,19.07) v1(16.47,11.69) v1(16.47,10.93) v1(16.47,10.17) v1(16.47,9.41) v1(17.17,14.3) v1(17.23,11.69) v1(17.23,10.93) v1(17.23,10.17) v1(17.23,9.41) v1(17.93,14.3) v1(20.27,9.15) v1(20.85,14.33) v1(21.82,0.6) v1(22,11.95) v1(22.4,31.66) v1(22.58,0.6) v1(22.91,19.68) v1(23.67,19.68) v1(24.16,3.83) v1(24.16,3.07) v1(24.43,19.68) v1(24.43,18.92) v1(24.92,3.83) v1(24.92,3.07) v1(25.19,19.68) v1(25.19,18.92) v1(25.26,0.6) v1(25.68,3.83) v1(25.68,3.07) v1(26.02,0.6) v1(26.44,3.83) v1(26.44,3.07) v1(26.78,0.6) v1(27.26,3.83) v1(27.26,3.07) v1(27.54,0.6) v1(27.71,7.93) v1(27.71,7.17) v1(27.99,39.55) v1(28.02,3.83) v1(28.02,3.07) v1(28.47,7.93) v1(28.47,7.17) v1(28.75,39.55) v1(28.78,3.83) v1(28.78,3.07) v1(29.23,7.93) v1(29.23,7.17) v1(29.32,26.78) v1(29.42,17.88) v1(29.42,17.12) v1(29.51,39.55) v1(29.54,3.83) v1(29.54,3.07) v1(29.99,7.93) v1(29.99,7.17) v1(30.18,17.88) v1(30.18,17.12) v1(30.42,3.83) v1(30.42,3.07) v1(31.18,3.83) v1(31.18,3.07) v1(31.46,0.6) v1(32.15,30.68) v1(32.15,29.92) v1(32.22,0.6) v1(32.98,0.6) v1(33.74,0.6) v1(34.49,39.42) v1(34.49,38.65) v1(35.12,8.83) v1(35.12,8.07) v1(35.25,39.42) v1(35.25,38.65) v1(35.47,31.85) v1(35.88,8.83) v1(35.88,8.07) v1(36.01,39.42) v1(36.01,38.65) v1(36.23,31.85) v1(36.77,39.42) v1(36.77,38.65) v1(38.72,36.19) v1(38.72,35.43) v1(38.72,34.67) v1(38.72,33.91) v1(38.92,15.49) v1(38.92,14.73) v1(38.92,13.97) v1(38.92,13.21) v1(38.96,32.09) v1(38.96,22.69) v1(38.96,19.14) v1(38.96,9.74) v1(39.09,24.35) v1(39.48,36.19) v1(39.48,35.43) v1(39.48,34.67) v1(39.48,33.91) v1(39.72,32.09) v1(39.72,22.69) v1(39.72,19.14) v1(39.68,15.49) v1(39.68,14.73) v1(39.68,13.97) v1(39.68,13.21) v1(39.72,9.74)
VBAT: length 102.3
  Bottom Layer w0.254: 8.42,10.12 8.42,9.37 7.95,8.9 5.96,8.9 R8.1 ; MP9943#2.7 8.37,20.7 7.97,20.3 5.25,20.3 4.79,20.76 4.79,21.38
  Bottom Layer w0.508: ESC2 M5-M6-M7-M8-CU-VB-VB-G.2 35.96,29.89 36.95,28.9 35.45,28.9 ESC2 M5-M6-M7-M8-CU-VB-VB-G.3 ; ESC1 M4-M3-M2-M1-CU-T7-VB-G.2 37.74,16.94 37.75,16.96
  Bottom Layer w0.762: 36.95,28.9 37.75,28.1 37.75,7.7 arc(37.79,7.49) 37.9,7.3 arc(38.5,3.65) 35.5,1.5 R22.2 19.2,1.5 17,3.7 9.7,3.7 7.45,1.45 5.2,1.45 arc(3.96,1.7) 2.9,2.4 arc(1.79,5) 2.8,7.65 arc(3.83,8.83) R8.1 4.12,10.07 4.1,10.05 3.75,10.4 3.75,18.1 4.79,19.14 R13.1
VDD_MCU: length 262.5
  Top Layer w0.152: 31.81,24.18 31.81,23.33 31.66,23.18 QMC5883L.4 ; 31.81,24.18 QMC5883L.2 ; 31.81,24.18 31.81,24.73 33.22,24.73 33.38,24.89 33.38,25.19 ; 32.29,27.23 SPL06.6
  Top Layer w0.254: 9.02,21.79 R4.2 8.76,22.94 v1(7.1,24.6) ; C6.2 10.75,7 ; C6.2 10.74,8.02 C8.1 C4.1 ; C6.2 11.5,8 STM32H743VGT6/VIT6.100 ; R45.1 23.84,26.81 23.84,29.35 ; 28.8,22.45 28.75,22.4 v1(27.8,22.4) ; 28.8,22.45 28.8,21.4 28.6,21.2 STM32H743VGT6/VIT6.50 ; 28.8,22.45 29.53,23.18 30.9,23.18 ; C35.1 9.79,28.16 9.79,27 ; C35.1 10.65,29.03 10.65,31.8 10.05,32.4 9.88,32.4 ; C35.1 8.77,28.17 ; STM32H743VGT6/VIT6.20 23.75,10.05 23.75,10.05 ; v1(20,3.9) 20.15,3.75 C5.1 C7.1 ; v1(39,20.25) 36.6,20.25 R2.1 R3.1 ; 9.8,25.94 9.8,26.99 9.79,27 ; v1(30.1,30.2) 25.55,30.2 24.7,29.35 23.84,29.35 ; QMC5883L.2 31,24.18 30.92,24.26 30.92,26.33 31.82,27.23 33.42,27.23 33.59,27.4 SPL06.8 34.15,28.26 34.15,29.85 v1(32.45,31.55) ; 30.9,23.18 30.91,23.17 30.91,21.95 C2.1 ; 30.9,23.18 QMC5883L.4 ; STM32H743VGT6/VIT6.75 14.25,21.57 17.37,18.45 v1(18.55,18.45) ; STM32H743VGT6/VIT6.11 19.25,9.9 19.4,10.05 v1(23.3,10.05) 23.75,10.05 ; C30.2 C29.2 31.01,9.7 STM32H743VGT6/VIT6.27 26.85,9.7 26.5,10.05 v1(24.75,10.05) 24.22,10.05 ; 24.22,10.05 24.25,10.02 STM32H743VGT6/VIT6.21 ; 24.22,10.05 23.75,10.05 ; 23.84,29.35 R43.1 ; 9.79,27 9.64,26.85 v1(8.75,26.85) ; SD/BLACKBOX.8 19.81,29.5 v1(19.15,28.85)
  Inner1 w0.254: v1(19.15,28.85) 19.15,27.64 v1(22.76,24.03)
  Inner2 w0.254: v1(20,3.9) 20,2.5 v1(18.35,0.85)
  Inner2 w0.508: v1(7.1,24.6) 7.1,25.2 v1(8.75,26.85) 10.15,26.85 v1(18.55,18.45) ; v1(18.55,18.45) 18.55,17.4 17.94,16.79 v1(17.94,15.65) 34.4,15.65 v1(39,20.25) ; v1(18.55,18.45) 22.5,22.4 v1(27.8,22.4) 30.1,24.7 v1(30.1,30.2) ; v1(20.05,33.3) 20.05,29.75 v1(19.15,28.85)
  Bottom Layer w0.152: AT7456E.24 27.24,36.01 27.15,36.1 27.15,38.95 26.55,39.55 24.52,39.55 R26.2 23.47,38.34 23.99,37.82 23.99,37.49 ; 23.99,37.49 24.05,37.55 25.23,37.55 25.5,37.28 25.5,35.8 25.29,35.59 AT7456E.21 ; 23.99,37.49 AT7456E.19 ; MPU6500.8 19.65,22.01 19.07,22.58 C26.2
  Bottom Layer w0.254: 22.35,15.2 22.85,14.7 C22.2 ; 22.35,15.2 21.3,16.25 19.9,16.25 19.75,16.1 BMI160.5 19.69,15.65 v1(17.94,15.65) 15.5,15.65 14.81,16.35 ; 22.35,15.2 22.34,15.2 BMI160.8 ; MPU6500.13 22.76,22.33 v1(22.76,24.03) ; 14.81,16.35 ME6217.5 ; 14.81,16.35 C14.2 C15.2 ; AT7456E.3 28.54,29.44 28.9,29.8 29.15,29.8 29.35,30 29.35,33.15 ; v1(18.55,18.45) 18.55,18.75 18.3,19 18.3,22.62 C25.2 C26.2 ; v1(18.35,0.85) 16.75,2.45 C3.1 13.83,2.45 SW1.4 ; 21.28,33.3 v1(20.05,33.3) ; 21.28,33.3 23.8,33.3 23.95,33.45 23.95,34.38 AT7456E.19 ; 21.28,33.3 R24.2 ; v1(20,3.9) 20,6.75 v1(23.3,10.05) ; v1(32.45,31.55) 30.95,31.55 29.35,33.15 ; C23.2 25.75,13.7 25.75,11.1 24.75,10.1 v1(24.75,10.05) ; AT7456E.24 27.24,33.81 27.8,33.25 29.25,33.25 29.35,33.15 ; R27.2 R26.2
  Bottom Layer w0.381: C15.2 15.68,12.45 17.37,12.45 17.98,11.84 17.98,7.77 17.21,7 v1(10.75,7)
AIRS: length 2.5
  Top Layer w0.254: AIRS.1 29.5,11.65 28.95,12.2 STM32H743VGT6/VIT6.32
BOOT0: length 12.1
  Top Layer w0.152: STM32H743VGT6/VIT6.94 13.7,12.2 13.85,12.05 13.85,9.24 10.62,6 R1.1
  vias: v1(10.48,2.45)
FB_5V: length 2.5
  Bottom Layer w0.152: R10.1 7.37,14.04 7.77,13.64 MP9943.1
FB_9V: length 2.3
  Bottom Layer w0.152: R15.1 7.47,25.76 7.69,25.53 7.69,24.21 MP9943#2.1
I2C1_CLK: length 16.3
  Top Layer w0.152: CLK1.1 5.84,24.61 R4.1 7.66,22.94 8.3,22.3 8.3,21.15 9.3,20.15 9.3,13.85 9.95,13.2 STM32H743VGT6/VIT6.92
I2C1_SDA: length 15.2
  Top Layer w0.152: STM32H743VGT6/VIT6.93 9.85,12.7 8.95,13.6 8.95,20.1 7.26,21.79 6.98,21.79 6.19,22.58 SDA1.1
I2C2_SCL: length 22.7
  Top Layer w0.152: QMC5883L.1 31.37,25.98 SPL06.4 31.64,26.59 31.8,26.75 34.9,26.75 37.35,24.3 37.35,21.55 36.9,21.1 36.05,21.1 35.65,20.7 35.65,19.81 R3.2 34.86,19.2 STM32H743VGT6/VIT6.46
I2C2_SDA: length 19.4
  Top Layer w0.152: 32.29,25.95 32.6,25.65 33.85,25.65 34.55,24.95 35.2,24.95 35.75,24.4 36.89,24.4 37.05,24.24 37.05,21.61 36.84,21.4 35.95,21.4 R2.2 34.25,19.7 STM32H743VGT6/VIT6.47 ; 32.29,25.95 31.88,25.54 31.88,25.19 ; 32.29,25.95 SPL06.3
LC_5V: length 12.2
  Bottom Layer w0.381: MP9943.6 9.07,11 9.45,11.38 10.21,11.38 10.47,11.12 10.47,9.56 R46.1 12.29,9.56 12.29,13.18 L1.1
LC_9V: length 11.8
  Bottom Layer w0.381: MP9943#2.6 9.02,22.46 9.41,22.86 9.96,22.86 10.47,22.35 10.47,21.55 R47.1 12.05,20.63 12.34,20.93 12.34,25.25 11.54,26.05 L2.1
LED_0: length 2.2
  Top Layer w0.152: STM32H743VGT6/VIT6.2 14.75,6.05 LED1.1
LED_1: length 3.9
  Top Layer w0.152: LED2.1 15.25,5.12 STM32H743VGT6/VIT6.3
NRST: length 7.6
  Top Layer w0.152: STM32H743VGT6/VIT6.14 20.75,6.45 21.05,6.15 21.65,6.15 21.7,6.1 21.7,4.45 21.6,4.35 19.84,4.35 18.75,3.27 C9.1
OTG_FS_DM: length 14.9
  Top Layer w0.152: STM32H743VGT6/VIT6.70 16.75,29.05 15.4,30.4 15.4,32.05 14.55,32.9 USB-C.5 14.55,35 14.3,35.25 13.8,35.25 13.55,35 USB-C.7
OTG_FS_DP: length 14.4
  Top Layer w0.152: USB-C.8 13.05,33.8 13.3,33.55 13.8,33.55 14.05,33.8 ; USB-C.6 14.05,33.8 ; 14.05,33.8 14.05,32.85 15.05,31.85 15.05,30.25 16.25,29.05 STM32H743VGT6/VIT6.71
PWM_1: length 4.8
  Top Layer w0.152: STM32H743VGT6/VIT6.34 v1(29.1,13.2)
  Bottom Layer w0.152: R32.2 29.91,14.01 v1(29.1,13.2)
PWM_2: length 4.9
  Top Layer w0.152: v1(29.85,13.2) 29.35,13.7 STM32H743VGT6/VIT6.35
  Bottom Layer w0.152: R31.2 30.44,12.61 v1(29.85,13.2)
PWM_3: length 13.8
  Top Layer w0.152: v1(31.55,5.8) 25.72,5.8 24.75,6.77 STM32H743VGT6/VIT6.22
  Bottom Layer w0.152: R30.2 31.55,10.52 v1(31.55,5.8)
PWM_4: length 11.7
  Top Layer w0.152: v1(32.25,6.2) 25.82,6.2 25.25,6.77 STM32H743VGT6/VIT6.23
  Bottom Layer w0.152: R29.2 32.24,6.21 v1(32.25,6.2)
PWM_5: length 17.8
  Top Layer w0.152: STM32H743VGT6/VIT6.24 v1(25.75,8.85)
  Bottom Layer w0.152: R35.2 29.3,20.95 27.8,19.45 27.15,19.45 26.7,19 26.7,9.05 26.5,8.85 v1(25.75,8.85)
PWM_6: length 18
  Top Layer w0.152: STM32H743VGT6/VIT6.25 v1(26.25,9.35)
  Bottom Layer w0.152: v1(26.25,9.35) 26.25,19.15 26.95,19.85 27.8,19.85 30.1,22.15 R34.2
PWM_7: length 12.8
  Top Layer w0.152: v1(22.8,21.25) 22.35,21.25 22.25,21.35 STM32H743VGT6/VIT6.59
  Bottom Layer w0.152: v1(22.8,21.25) 22.8,20.52 22.97,20.35 27.8,20.35 30.79,23.34 R36.2
PWM_8: length 13.1
  Top Layer w0.152: v1(23.2,20.75) 22.2,20.75 21.75,21.2 STM32H743VGT6/VIT6.60
  Bottom Layer w0.152: v1(23.2,20.75) 27.8,20.75 31.55,24.5 R33.2
PWM_9: length 6.3
  Top Layer w0.152: STM32H743VGT6/VIT6.61 21.25,23.9 21.45,24.1 22,24.1 23.5,25.6 R37.2
PWM_10: length 7.5
  Top Layer w0.152: STM32H743VGT6/VIT6.62 20.75,24.09 21.06,24.4 21.9,24.4 23.6,26.1 24.25,26.1 24.95,26.8 R38.2
PWM_11: length 2.2
  Top Layer w0.152: R39.2 15.75,5.63 STM32H743VGT6/VIT6.4
PWM_12: length 2.5
  Top Layer w0.152: R40.2 16.25,6.43 STM32H743VGT6/VIT6.5
PWM_SW_2812: length 9.8
  Top Layer w0.152: 20.5,31.66 20.5,31.3 18.25,29.05 STM32H743VGT6/VIT6.67
SDIO_CLK: length 19.7
  Top Layer w0.152: SD/BLACKBOX.3 14.02,26.97 14.65,27.59 14.65,29.5 14.07,30.08 12.17,30.08 12,29.91 12,29 10.43,27.43 10.43,20.17 11.4,19.2 STM32H743VGT6/VIT6.80
SDIO_CMD: length 20.2
  Top Layer w0.152: SD/BLACKBOX.5 21.22,25.69 v1(21.68,26.15) R45.2 ; STM32H743VGT6/VIT6.83 v1(13.9,17.7)
  Bottom Layer w0.152: v1(13.9,17.7) 16.95,17.7 17.65,18.4 17.65,21.6 16.6,22.65 16.6,25.2 17.55,26.15 v1(21.68,26.15)
SDIO_D0: length 7.6
  Top Layer w0.152: R44.2 21.22,26.97 SD/BLACKBOX.6 19.57,26.97 19.25,26.65 STM32H743VGT6/VIT6.65
SDIO_D1: length 9
  Top Layer w0.152: R43.2 21.22,28.23 SD/BLACKBOX.7 19.57,28.23 18.75,27.42 STM32H743VGT6/VIT6.66
SDIO_D2: length 14.3
  Top Layer w0.152: STM32H743VGT6/VIT6.78 11.4,20.2 11,20.6 11,25.39 R41.1 11.64,25.69 12.05,26.1 12.05,27.5 12.15,27.6 14,27.6 14.2,27.8 14.2,29.25 13.94,29.5 SD/BLACKBOX.1
SDIO_D3: length 12.1
  Top Layer w0.152: STM32H743VGT6/VIT6.79 11.35,19.7 10.7,20.35 10.7,26.56 11.14,27 11.3,27 11.3,27.83 11.7,28.23 SD/BLACKBOX.2
SENS_CUR: length 42
  Top Layer w0.152: STM32H743VGT6/VIT6.16 21.75,6.8 23.2,5.35 v1(32.25,5.35)
  Bottom Layer w0.152: v1(32.25,5.35) 32.85,5.95 32.85,8.7 33.3,9.15 34.45,9.15 35.5,10.2 36.15,10.2 36.5,10.55 36.5,14.65 36.21,14.94 ESC1 M4-M3-M2-M1-CU-T7-VB-G.4 34.71,14.94 34.5,15.15 34.5,17.15 34.8,17.45 36.5,17.45 36.95,17.9 36.95,27.06 36.12,27.89 ESC2 M5-M6-M7-M8-CU-VB-VB-G.4
SENS_VOL: length 7.5
  Top Layer w0.152: 23.1,3.15 23.1,4.1 v1(22.3,4.9) 22.3,5.86 21.71,6.45 21.35,6.45 21.25,6.55 STM32H743VGT6/VIT6.15
  Bottom Layer w0.152: v1(22.3,4.9) 22.55,4.65 R22.1
SPI1_IMU1_CS: length 7.2
  Top Layer w0.152: STM32H743VGT6/VIT6.9 18.25,10.15 19.85,11.75 v1(20.75,11.75)
  Bottom Layer w0.152: v1(20.75,11.75) BMI160.12
SPI1_MISO: length 11.1
  Top Layer w0.152: v1(22.35,11.15) 27.75,11.15 STM32H743VGT6/VIT6.30
  Bottom Layer w0.152: v1(22.35,11.15) 19.55,11.15 18.85,11.85 18.86,11.86 BMI160.1
SPI1_MOSI: length 8.4
  Top Layer w0.152: v1(19.75,14.35) 18.9,15.2 STM32H743VGT6/VIT6.88
  Bottom Layer w0.152: v1(19.75,14.35) BMI160.14
SPI1_SCLK: length 9.9
  Top Layer w0.152: v1(20.25,12.15) 21.27,12.15 21.5,11.92 21.5,10.95 21.75,10.7 STM32H743VGT6/VIT6.29
  Bottom Layer w0.152: v1(20.25,12.15) BMI160.13
SPI2_MISO: length 6.7
  Top Layer w0.152: v1(24.85,23.95) 25.25,23.55 STM32H743VGT6/VIT6.53
  Bottom Layer w0.152: v1(24.85,23.95) 23.34,25.46 AT7456E.11
SPI2_MOSI: length 9.3
  Top Layer w0.152: STM32H743VGT6/VIT6.54 v1(24.75,21.6)
  Bottom Layer w0.152: AT7456E.9 24.64,25.36 25.95,24.05 25.95,22.8 v1(24.75,21.6)
SPI2_OSD_CS: length 6.6
  Top Layer w0.152: STM32H743VGT6/VIT6.51 26.25,23.65 v1(26.55,23.95)
  Bottom Layer w0.152: v1(26.55,23.95) 25.29,25.21 AT7456E.8
SPI2_SCLK: length 6.7
  Top Layer w0.152: STM32H743VGT6/VIT6.52 25.75,23.65 v1(25.45,23.95)
  Bottom Layer w0.152: AT7456E.10 23.99,25.41 v1(25.45,23.95)
SPI3_IMU3_CS: length 13.6
  Top Layer w0.152: v1(26.06,4.32) 26.06,2.09 SPICS3.1 ; v1(17.25,6.34) STM32H743VGT6/VIT6.7
  Inner1 w0.152: v1(17.25,6.34) 18.05,5.54 24.84,5.54 v1(26.06,4.32)
SPI3_MISO: length 3.6
  Top Layer w0.152: U17.1 10.2,15 11,14.2 STM32H743VGT6/VIT6.90
SPI3_MOSI: length 2.6
  Top Layer w0.152: U16.1 10.47,13.7 STM32H743VGT6/VIT6.91
SPI3_SCLK: length 1.6
  Top Layer w0.152: U18.1 11.5,14.7 STM32H743VGT6/VIT6.89
SPI4_IMU2_CS: length 9.9
  Top Layer w0.152: STM32H743VGT6/VIT6.41 v1(20.05,16.7)
  Bottom Layer w0.152: v1(20.05,16.7) MPU6500.22
SPI4_MISO: length 21.6
  Top Layer w0.152: v1(17.95,17.7) STM32H743VGT6/VIT6.43
  Bottom Layer w0.152: MPU6500.9 20.05,23.55 19.65,23.95 17.1,23.95 16.9,23.75 16.9,22.71 17.95,21.66 v1(17.95,17.7)
SPI4_MOSI: length 9.2
  Top Layer w0.152: STM32H743VGT6/VIT6.44 v1(19.25,18.2)
  Bottom Layer w0.152: MPU6500.24 v1(19.25,18.2)
SPI4_SCLK: length 9.8
  Top Layer w0.152: STM32H743VGT6/VIT6.42 v1(19.65,17.2)
  Bottom Layer w0.152: v1(19.65,17.2) MPU6500.23
SW_CAMERA: length 24.7
  Top Layer w0.152: STM32H743VGT6/VIT6.58 22.75,21.83 23.38,21.2 v1(23.5,21.2)
  Bottom Layer w0.152: v1(23.5,21.2) 27.85,21.2 30.9,24.25 30.9,25.05 31.1,25.25 33.1,25.25 33.4,25.55 33.4,26.3 34.4,27.3 34.4,30.15 34.65,30.4 36.55,30.4 38.55,28.4 v1(39.1,28.4)
SWD_SWCLK: length 8.5
  Top Layer w0.152: SWCLK.1 14.8,24.95 11.69,24.95 11.3,24.56 11.3,21.6 11.7,21.2 STM32H743VGT6/VIT6.76
SWD_SWDIO: length 3.5
  Top Layer w0.152: STM32H743VGT6/VIT6.72 15.75,25.25 SWDIO.1
UART1_RX: length 9.1
  Top Layer w0.152: STM32H743VGT6/VIT6.69 17.25,31.12 16.7,31.67
UART1_TX: length 9.3
  Top Layer w0.152: 18.6,31.67 18.5,31.57 18.5,30.15 17.75,29.4 STM32H743VGT6/VIT6.68
UART2_RX: length 15.5
  Top Layer w0.152: STM32H743VGT6/VIT6.87 11.45,15.7 9.75,17.4 9.75,23.7 6.81,26.64 R2#2.1
UART2_TX: length 16.4
  Top Layer w0.152: STM32H743VGT6/VIT6.86 11.35,16.2 10,17.55 10,24.33 5.66,28.67 T2.1
UART3_RX: length 19.6
  Top Layer w0.152: G-G-T3-R3-9V-R6.4 26.79,34.81 28.5,33.1 29.2,33.1 30.8,31.5 30.8,27.55 28.15,24.9 24.5,24.9 23.75,24.15 STM32H743VGT6/VIT6.56
UART3_TX: length 27.1
  Top Layer w0.152: T3.1 22.03,39.07 23.2,37.9 24.45,37.9 26.05,36.3 27.55,36.3 27.79,36.06 G-G-T3-R3-9V-R6.3 27.79,34.31 28.7,33.4 29.35,33.4 31.15,31.6 31.15,27.5 28.25,24.6 24.7,24.6 24.25,24.15 STM32H743VGT6/VIT6.55
UART4_RX: length 14
  Top Layer w0.152: STM32H743VGT6/VIT6.95 10.25,11.7 8.65,13.3 8.65,18.52 6.62,20.55 R4#2.1
UART4_TX: length 13.3
  Top Layer w0.152: STM32H743VGT6/VIT6.96 10.2,11.2 8.35,13.05 8.35,18.25 8.09,18.51 T4.1
UART6_RX: length 15.3
  Top Layer w0.152: STM32H743VGT6/VIT6.64 19.75,24.45 20.3,25 21.61,25 22.95,26.34 22.95,30.05 24.3,31.4 24.3,33.8 24.79,34.29 G-G-T3-R3-9V-R6.6
UART6_TX: length 12.9
  Top Layer w0.152: 26.25,31.65 26.25,31.43 25.17,30.35 23.7,30.35 23.25,29.9 23.25,26.2 21.75,24.7 20.7,24.7 20.25,24.25 STM32H743VGT6/VIT6.63
UART7_RX: length 13.3
  Top Layer w0.152: v1(36.95,13.55) RX7.1 33.64,13.55 32.49,14.7 STM32H743VGT6/VIT6.37
  Bottom Layer w0.152: v1(36.95,13.55) 36.95,15.5 36.51,15.94 ESC1 M4-M3-M2-M1-CU-T7-VB-G.3
UART7_TX: length 7.2
  Top Layer w0.152: TX7.1 34.59,15.2 STM32H743VGT6/VIT6.38
UART8_RX: length 7.8
  Top Layer w0.152: STM32H743VGT6/VIT6.97 10.15,10.7 9.25,11.6 5.33,11.6 5.3,11.63
UART8_TX: length 7.6
  Top Layer w0.152: 5.3,10.63 9.72,10.63 10.15,10.2 STM32H743VGT6/VIT6.98
VCAP1: length 1.8
  Top Layer w0.152: C10.1 29.25,20.2 STM32H743VGT6/VIT6.48
VCAP2: length 4.2
  Top Layer w0.254: STM32H743VGT6/VIT6.73 15.25,23.55 14.9,23.9 12.04,23.9 C11.1
VIDIN: length 23
  Top Layer w0.152: v1(39.09,30.48) 36.77,32.8 34.55,32.8 32.9,34.45 32.9,36.6 31.85,37.65 27.65,37.65 v1(26.2,39.1)
  Bottom Layer w0.152: v1(26.2,39.1) 26.21,39.09 C33.2 26.85,37.63 26.85,36.21 25.94,35.3 AT7456E.22
VTX: length 4.2
  Top Layer w0.254: v1(31.8,36.4) 31.8,33.71 VTX.1
  Bottom Layer w0.152: R25.2 31.38,36.82 v1(31.8,36.4)
$1N2867: length 2.8
  Top Layer w0.152: STM32H743VGT6/VIT6.12 19.75,6.55 18.95,5.75 18.95,5.4 X1.3
$1N2871: length 2.8
  Top Layer w0.152: STM32H743VGT6/VIT6.13 20.25,6.55 21.19,5.61 21.19,5.25
$1N3300: length 2.3
  Top Layer w0.254: USB-C.10 v1(12.05,35.25)
  Bottom Layer w0.254: R7.2 12.05,35.74 v1(12.05,35.25)
$1N3472: length 2.3
  Top Layer w0.254: USB-C.4 v1(15.05,35.25)
  Bottom Layer w0.254: R6#2.2 15.05,35.74 v1(15.05,35.25)
$1N5215: length 5.7
  Bottom Layer w0.152: MP9943.3 9.07,11.7 8.65,11.28 6.99,11.28 6.69,10.98 5.39,10.98 R8.2
$1N5401: length 1.7
  Bottom Layer w0.254: MP9943.4 11.26,12.62 C17.1
$1N5477: length 4.8
  Bottom Layer w0.152: R9.1 6.15,11.58 8.22,11.58 8.42,11.78 8.42,12.62
  Bottom Layer w0.254: 6.13,13.18 6.13,11.59 R9.1
$1N5478: length 1.6
  Bottom Layer w0.254: R9.2 7.72,10.07 MP9943.8
$1N5616: length 3.4
  Bottom Layer w0.152: R12.2 6.03,16.25 R11.1 R10.2
$1N5946: length 5.8
  Bottom Layer w0.152: R13.2 5.39,22.28 6.59,22.28 7.19,22.88 8.69,22.88 9.02,23.21 MP9943#2.3
$1N5955: length 1.9
  Bottom Layer w0.381: MP9943#2.4 10.99,24.18 C19.1
$1N5966: length 4.9
  Bottom Layer w0.152: MP9943#2.2 8.37,23.37 8.18,23.18 6.4,23.18 R14.1
  Bottom Layer w0.254: R14.1 C18.2
$1N5971: length 1.8
  Bottom Layer w0.152: 6.09,21.38 6.4,21.68 MP9943#2.8
$1N5978: length 3.4
  Bottom Layer w0.152: R17.2 6.16,27.68 R16.1 R15.2
$1N6188: length 1.3
  Top Layer w0.152: SPL06.5 31.64,28.62 R18.2
$1N7216: length 1.7
  Bottom Layer w0.152: C24.2 20.45,22.79 MPU6500.10
$1N7601: length 3.7
  Top Layer w0.152: 36.07,22.23 35.47,21.63 33.77,21.63 33.38,22.02 QMC5883L.8
$1N7606: length 2.7
  Top Layer w0.152: 36.07,23.63 36.07,23.72 35.11,24.68 QMC5883L.12
$1N7687: length 1.1
  Top Layer w0.152: C28.1 33.95,23.63 QMC5883L.10
$1N8096: length 1.3
  Top Layer w0.152: R19.1 11.34,5.6 LED1.2
$1N8099: length 1.3
  Top Layer w0.152: R20.1 11.32,4.18 LED2.2
$1N8102: length 1.6
  Top Layer w0.254: LED3.2 8.17,30.97 R21.1
$1N8750: length 7.1
  Bottom Layer w0.152: AT7456E.5 27.24,27.76 27.4,27.6 30.25,27.6 30.4,27.45 30.4,26.1 27MHZ.3
$1N8757: length 2.1
  Bottom Layer w0.152: 27.12,26.83 26.59,27.35 AT7456E.6
$1N8872: length 4
  Bottom Layer w0.152: AT7456E.12 22.69,29.31 21.57,30.43 19.8,30.43
$1N10347: length 2.7
  Bottom Layer w0.152: C31.1 29.15,36.71 28.54,36.1 AT7456E.26
$1N10350: length 2.5
  Bottom Layer w0.152: C32.1 27.89,36.82 AT7456E.25
$1N10453: length 2.8
  Bottom Layer w0.152: C32.2 C31.2 30.53,38.31 R25.1
$1N10536: length 2.4
  Bottom Layer w0.152: R26.1 23.34,36.8 AT7456E.18
$1N10539: length 2.7
  Bottom Layer w0.152: AT7456E.17 22.69,36.09 R27.1
$1N10759: length 2.1
  Bottom Layer w0.152: C33.1 26.21,37.04 24.92,38.33 R28.2
$1N44323: length 1.2
  Bottom Layer w0.254: C17.2 R46.2
$1N44357: length 1
  Bottom Layer w0.381: R47.2 C19.2
$2N2764: length 2.2
  Bottom Layer w0.152: ESC1 M4-M3-M2-M1-CU-T7-VB-G.8 34.31,9.81 R29.1
$2N2888: length 2.1
  Bottom Layer w0.152: ESC1 M4-M3-M2-M1-CU-T7-VB-G.7 34.4,11.94 33.75,11.29 R30.1
$2N2891: length 1.8
  Bottom Layer w0.152: R31.1 35.11,12.61 ESC1 M4-M3-M2-M1-CU-T7-VB-G.6
$2N2894: length 1.7
  Bottom Layer w0.152: ESC1 M4-M3-M2-M1-CU-T7-VB-G.5 35.38,14.01 R32.1
$2N3208: length 3.9
  Top Layer w0.152: M9.1 28.25,25.95 27.9,25.6 R37.1
$2N3210: length 2.6
  Top Layer w0.152: M10.1 26.4,28.48 26.4,27.05 26.65,26.8 R38.1
$2N3307: length 2.6
  Top Layer w0.152: R39.1 15.87,2.55 M11.1
$2N3309: length 2.3
  Top Layer w0.152: R40.1 17.17,1.8 M12.1
$2N5119: length 4.1
  Bottom Layer w0.152: ESC2 M5-M6-M7-M8-CU-VB-VB-G.5 35.4,26.85 34.45,26.85 33.75,26.15 33.75,24.85 33.45,24.55 R33.1
$2N5121: length 4.2
  Bottom Layer w0.152: ESC2 M5-M6-M7-M8-CU-VB-VB-G.7 34.66,24.89 34.35,24.58 34.35,23.44 R34.1
$2N5123: length 4.3
  Bottom Layer w0.152: R35.1 34.65,22.54 34.65,23.75 34.66,23.75 34.8,23.89 ESC2 M5-M6-M7-M8-CU-VB-VB-G.8
$2N5125: length 3.9
  Bottom Layer w0.152: R36.1 34.05,24.33 34.05,25.05 34.89,25.89 ESC2 M5-M6-M7-M8-CU-VB-VB-G.6

## Copper pours and planes (outline as drawn; the poured copper is in the pictures)
5V_BEC on Top Layer: 31.1,12.35 35.9,12.35 35.9,10.85 31.1,10.85
5V_BEC on Top Layer: 0.7,30.4 2.8,30.4 2.8,22.75 0.7,22.75
GND on Top Layer: 32.07,24.48 33.47,24.48 33.47,23.13 32.07,23.13
GND on Top Layer: -0.9,41.5 41.55,41.5 41.55,-0.5 -0.9,-0.5
GND on Bottom Layer: 20.15,15.95 20.85,15.95 20.85,13.92 20.15,13.92
GND on Bottom Layer: -0.9,41.5 41.55,41.5 41.55,-0.5 -0.9,-0.5
GND on Inner1: -0.9,41.5 41.55,41.5 41.55,-0.5 -0.9,-0.5
GND on Inner2: -0.9,41.5 41.55,41.5 41.55,-0.5 -0.9,-0.5
VDD_MCU on Bottom Layer: 22.9,15.05 25.2,15.05 25.2,14.3 22.9,14.3

Small or netless copper shapes (teardrops, artwork), in the pictures only: 320 on Top Layer, 224 on Bottom Layer, 10 on Inner2

## Text on the board
Bottom Solder Mask Layer: 20240308_V0.5 | Designed by urmouky
Bottom Silkscreen Layer: ESC1 | BOOT | ESC2
Top Silkscreen Layer: MISO3 | MOSI3 | SPICLK3
